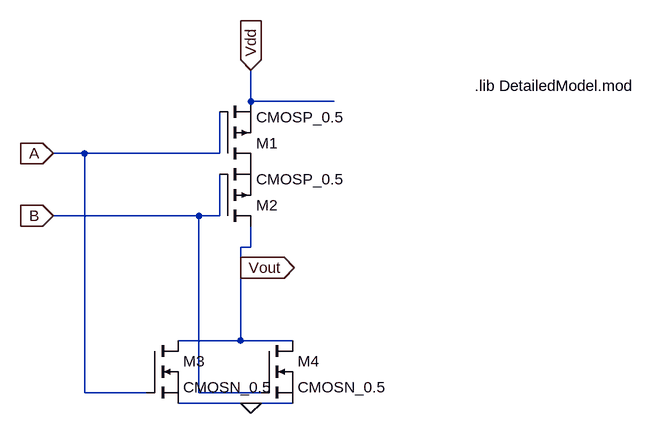
[diagram p0: schematic nor.asc]
nor.asc, the LTspice schematic file:
Version 4
SHEET 1 880 680
WIRE 176 64 176 16
WIRE 304 64 176 64
WIRE -80 144 -128 144
WIRE 128 144 128 80
WIRE 128 144 -80 144
WIRE 96 240 -128 240
WIRE 128 240 128 176
WIRE 128 240 96 240
WIRE 176 288 176 256
WIRE 176 288 160 288
WIRE 160 320 160 288
WIRE 160 432 160 320
WIRE 160 432 64 432
WIRE 240 432 160 432
WIRE -80 512 -80 144
WIRE 16 512 -80 512
WIRE 96 512 96 240
WIRE 192 512 96 512
WIRE 176 528 64 528
WIRE 240 528 176 528
FLAG 176 528 0
FLAG -128 144 A
IOPIN -128 144 In
FLAG -128 240 B
IOPIN -128 240 In
FLAG 160 320 Vout
IOPIN 160 320 Out
FLAG 176 16 Vdd
IOPIN 176 16 In
SYMBOL pmos 128 160 M180
SYMATTR InstName M1
SYMATTR Value CMOSP_0.5
SYMBOL pmos 128 256 M180
SYMATTR InstName M2
SYMATTR Value CMOSP_0.5
SYMBOL nmos 16 432 R0
SYMATTR InstName M3
SYMATTR Value CMOSN_0.5
SYMBOL nmos 192 432 R0
SYMATTR InstName M4
SYMATTR Value CMOSN_0.5
TEXT 520 40 Left 2 !.lib DetailedModel.mod

The netlist it stands for:
* nor.asc
M1 P001 A Vdd Vdd CMOSP_0.5
M2 Vout B P001 P001 CMOSP_0.5
M3 Vout A 0 0 CMOSN_0.5
M4 Vout B 0 0 CMOSN_0.5
.model NMOS NMOS
.model PMOS PMOS
.lib standard.mos
.lib DetailedModel.mod
.backanno
.end